# Altium schematic sheet Output Transceivers.SchDoc
size A2; SheetNumber: 6; SheetTotal: 8
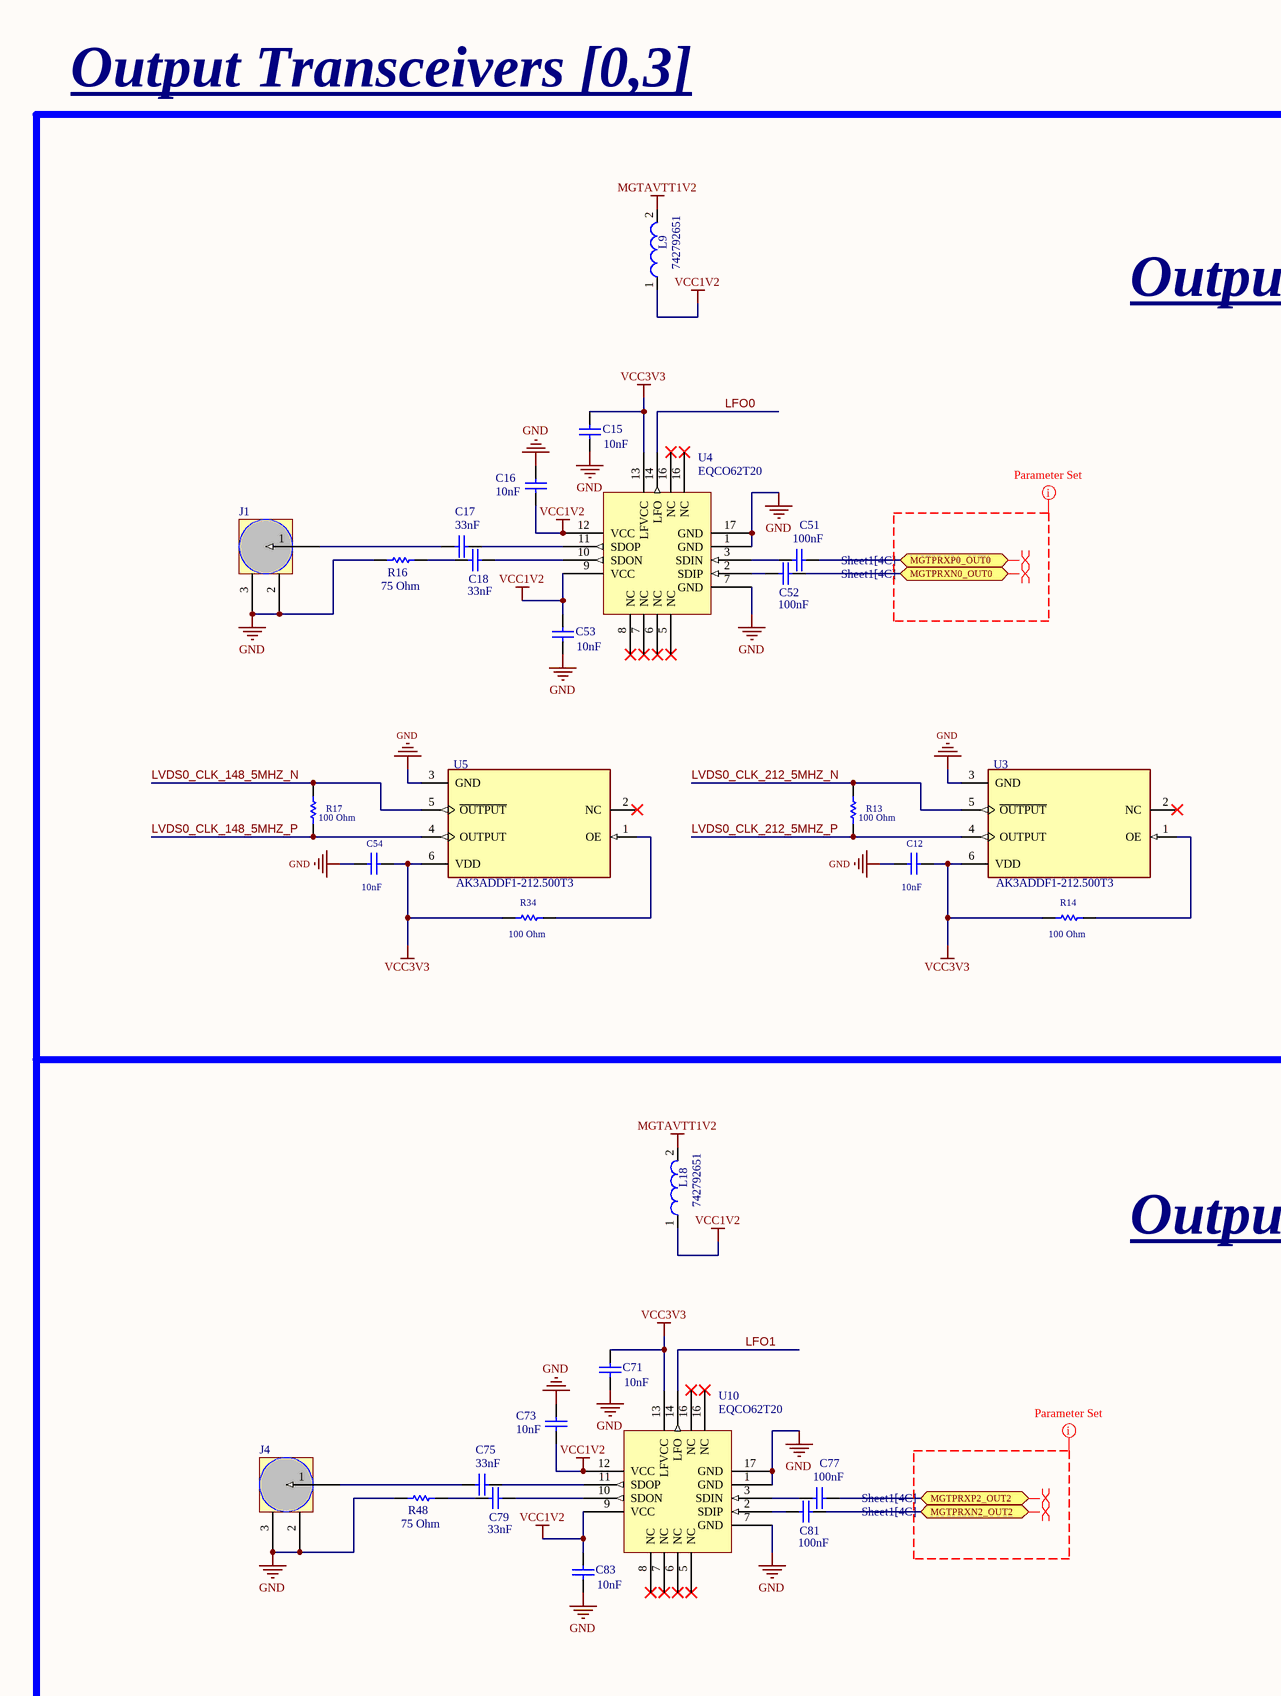
[diagram p0: Output Transceivers.SchDoc, left]
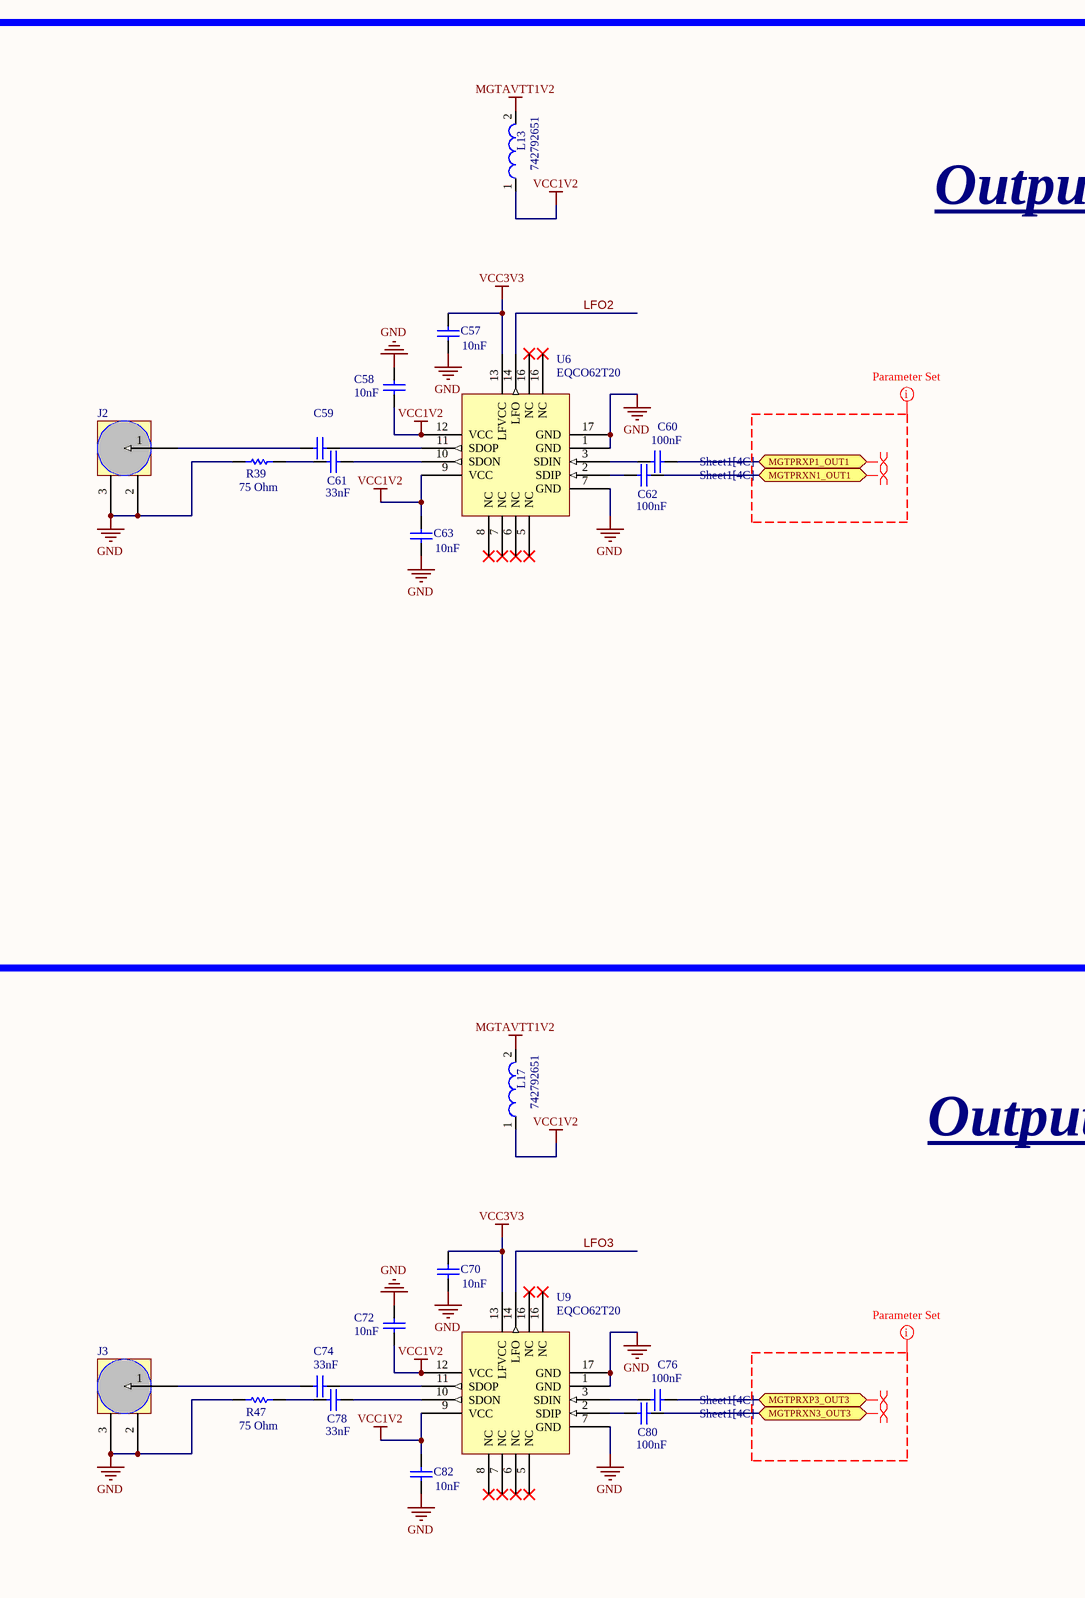
[diagram p1: Output Transceivers.SchDoc, right]

## Parts
C12  10nF  [0402]
C15  10nF  [0402]
C16  10nF  [0402]
C17  33nF  [0603]
C18  33nF  [0603]
C51  100nF  [0402]
C52  100nF  [0402]
C53  10nF  [0402]
C54  10nF  [0402]
C57  10nF  [0402]
C58  10nF  [0402]
C59  33nF  [0603]  (value not drawn)
C60  100nF  [0402]
C61  33nF  [0603]
C62  100nF  [0402]
C63  10nF  [0402]
C70  10nF  [0402]
C71  10nF  [0402]
C72  10nF  [0402]
C73  10nF  [0402]
C74  33nF  [0603]
C75  33nF  [0603]
C76  100nF  [0402]
C77  100nF  [0402]
C78  33nF  [0603]
C79  33nF  [0603]
C80  100nF  [0402]
C81  100nF  [0402]
C82  10nF  [0402]
C83  10nF  [0402]
J1  (no value)  [PCBComponent_1 - duplicate]
J2  (no value)  [PCBComponent_1 - duplicate]
J3  (no value)  [PCBComponent_1 - duplicate]
J4  (no value)  [PCBComponent_1 - duplicate]
L9  742792651  [SMD-0603]
L13  742792651  [SMD-0603]
L17  742792651  [SMD-0603]
L18  742792651  [SMD-0603]
R13  100 Ohm  [3-0603]
R14  100 Ohm  [3-0603]
R16  75 Ohm  [3-0603]
R17  100 Ohm  [3-0603]
R34  100 Ohm  [3-0603]
R39  75 Ohm  [3-0603]
R47  75 Ohm  [3-0603]
R48  75 Ohm  [3-0603]
U3  AK3ADDF1-212.500T3  [AX3DAF1-148.5000T]
U4  EQCO62T20  [PCBComponent_1_2]
U5  AK3ADDF1-212.500T3  [AX3DAF1-148.5000T]
U6  EQCO62T20  [PCBComponent_1_2]
U9  EQCO62T20  [PCBComponent_1_2]
U10  EQCO62T20  [PCBComponent_1_2]

## Ports
MGTPRXN0_OUT0 (bidir, see Sheet1[4C]), MGTPRXN1_OUT1 (bidir, see Sheet1[4C]), MGTPRXN2_OUT2 (bidir, see Sheet1[4C]), MGTPRXN3_OUT3 (bidir, see Sheet1[4C]), MGTPRXP0_OUT0 (bidir, see Sheet1[4C]), MGTPRXP1_OUT1 (bidir, see Sheet1[4C]), MGTPRXP2_OUT2 (bidir, see Sheet1[4C]), MGTPRXP3_OUT3 (bidir, see Sheet1[4C])

## Nets
GND: C12.1 C15.1 C16.2 C53.1 C54.1 C57.1 C58.2 C63.1 C70.1 C71.1 C72.2 C73.2 C82.1 C83.1 J1.2 J1.3 J2.2 J2.3 J3.2 J3.3 J4.2 J4.3 R16.1 R39.1 R47.1 R48.1 U3.3(GND) U4.1(GND) U4.7(GND) U4.17(GND) U5.3(GND) U6.1(GND) U6.7(GND) U6.17(GND) U9.1(GND) U9.7(GND) U9.17(GND) U10.1(GND) U10.7(GND) U10.17(GND)
MGTAVTT1V2: L9.2 L13.2 L17.2 L18.2
VCC1V2: C16.1 C53.2 C58.1 C63.2 C72.1 C73.1 C82.2 C83.2 L9.1 L13.1 L17.1 L18.1 U4.9(VCC) U4.12(VCC) U6.9(VCC) U6.12(VCC) U9.9(VCC) U9.12(VCC) U10.9(VCC) U10.12(VCC)
VCC3V3: C12.2 C15.2 C54.2 C57.2 C70.2 C71.2 R14.1 R34.1 U3.6(VDD) U4.13(LFVCC) U5.6(VDD) U6.13(LFVCC) U9.13(LFVCC) U10.13(LFVCC)
LFO0: U4.14(LFO)
LFO1: U10.14(LFO)
LFO2: U6.14(LFO)
LFO3: U9.14(LFO)
LVDS0_CLK_148_5MHZ_N: R17.2 U5.5(~{OUTPUT})
LVDS0_CLK_148_5MHZ_P: R17.1 U5.4(OUTPUT)
LVDS0_CLK_212_5MHZ_N: R13.2 U3.5(~{OUTPUT})
LVDS0_CLK_212_5MHZ_P: R13.1 U3.4(OUTPUT)
MGTPRXN0_OUT0: C52.2 ; port MGTPRXN0_OUT0
MGTPRXN1_OUT1: C62.2 ; port MGTPRXN1_OUT1
MGTPRXN2_OUT2: C81.2 ; port MGTPRXN2_OUT2
MGTPRXN3_OUT3: C80.2 ; port MGTPRXN3_OUT3
MGTPRXP0_OUT0: C51.2 ; port MGTPRXP0_OUT0
MGTPRXP1_OUT1: C60.2 ; port MGTPRXP1_OUT1
MGTPRXP2_OUT2: C77.2 ; port MGTPRXP2_OUT2
MGTPRXP3_OUT3: C76.2 ; port MGTPRXP3_OUT3
NetC17_1: C17.1 J1.1
NetC17_2: C17.2 U4.11(SDOP)
NetC18_1: C18.1 R16.2
NetC18_2: C18.2 U4.10(SDON)
NetC51_1: C51.1 U4.3(SDIN)
NetC52_1: C52.1 U4.2(SDIP)
NetC59_1: C59.1 J2.1
NetC59_2: C59.2 U6.11(SDOP)
NetC60_1: C60.1 U6.3(SDIN)
NetC61_1: C61.1 R39.2
NetC61_2: C61.2 U6.10(SDON)
NetC62_1: C62.1 U6.2(SDIP)
NetC74_1: C74.1 J3.1
NetC74_2: C74.2 U9.11(SDOP)
NetC75_1: C75.1 J4.1
NetC75_2: C75.2 U10.11(SDOP)
NetC76_1: C76.1 U9.3(SDIN)
NetC77_1: C77.1 U10.3(SDIN)
NetC78_1: C78.1 R47.2
NetC78_2: C78.2 U9.10(SDON)
NetC79_1: C79.1 R48.2
NetC79_2: C79.2 U10.10(SDON)
NetC80_1: C80.1 U9.2(SDIP)
NetC81_1: C81.1 U10.2(SDIP)
NetR14_2: R14.2 U3.1(OE)
NetR34_2: R34.2 U5.1(OE)

Not connected (* = marked no-connect by the designer): U3 2(NC)*; U4 5(NC)* 6(NC)* 8(NC)* 16(NC)*; U5 2(NC)*; U6 5(NC)* 6(NC)* 8(NC)* 16(NC)*; U9 5(NC)* 6(NC)* 8(NC)* 16(NC)*; U10 5(NC)* 6(NC)* 8(NC)* 16(NC)*

## Layout directives
differential pair: MGTPRXN0_OUT0, MGTPRXN1_OUT1, MGTPRXN2_OUT2, MGTPRXN3_OUT3, MGTPRXP0_OUT0, MGTPRXP1_OUT1, MGTPRXP2_OUT2, MGTPRXP3_OUT3

## Notes on the sheet
- Output Transceivers [0,3]
- Output 0
- Output 2
- Output 1
- Output 3

## Library data of the parts
C12 C15 C16 C53 C54 C57 C58 C63 C70-C73 C82 C83 = C0402: C0402C103K9RACTU 10nF 6.3V; Note: Footprint corresponds to dimensions for bulk cassette packaging. This case size has tightened tolerances.; Published: 17-Jul-2002; LatestRevisionDate: 19-Mar-2004; LatestRevisionNote: Silkscreen size reduced.; DatasheetDocument: Mar-2001; PackageDocument: Mar-2001; PackageReference: 0402; Publisher: Altium Limited; Code_JEITA: 0402; Code_IPC: 1005 [0402]; ComponentLink1Description: Manufacturer Link; ComponentLink1URL: http://www.kemet.com/; ComponentLink2Description: Datasheet; ComponentLink2URL: http://www.kemet.com/kemet/web/homepage/kechome.nsf/vapubfilesname/F3102TA.pdf/$file/F3102TA.pdf
C17 C18 C59 C61 C74 C75 C78 C79 = C0603: C0603C333K5RACTU 33nF 50V; Note: Footprint corresponds to dimensions for bulk cassette packaging. This case size has tightened tolerances.; Published: 17-Jul-2002; LatestRevisionDate: 19-Mar-2004; LatestRevisionNote: Silkscreen size reduced.; DatasheetDocument: Mar-2001; PackageDocument: Mar-2001; PackageReference: 0603; Publisher: Altium Limited; Code_JEITA: 0603; Code_IPC: 1608 [0603]; ComponentLink1Description: Manufacturer Link; ComponentLink1URL: http://www.kemet.com/; ComponentLink2Description: Datasheet; ComponentLink2URL: http://www.kemet.com/kemet/web/homepage/kechome.nsf/vapubfilesname/F3102TA.pdf/$file/F3102TA.pdf
  C17 C18 C61 C74 C75 C78 C79: Value: 33nF
C51 C52 C60 C62 C76 C77 C80 C81 = C0402: C0402C104K8RACTU 100nF 10V; Note: Footprint corresponds to dimensions for bulk cassette packaging. This case size has tightened tolerances.; Published: 17-Jul-2002; LatestRevisionDate: 19-Mar-2004; LatestRevisionNote: Silkscreen size reduced.; DatasheetDocument: Mar-2001; PackageDocument: Mar-2001; PackageReference: 0402; Publisher: Altium Limited; Code_JEITA: 0402; Code_IPC: 1005 [0402]; ComponentLink1Description: Manufacturer Link; ComponentLink1URL: http://www.kemet.com/; ComponentLink2Description: Datasheet; ComponentLink2URL: http://www.kemet.com/kemet/web/homepage/kechome.nsf/vapubfilesname/F3102TA.pdf/$file/F3102TA.pdf; Value: 100nF
J1-J4 = Component_1: Amphenol_BNC_HD_034_1018
L9 L13 L17 L18 = 742792651: SMD EMI Suppression Ferrite Bead WE-CBF, Z = 600 Ohm; Impedance: 600 Ohm; DatasheetVersion: Dec-2005; PackageVersion: 2009; PackageReference: SMD-0603; PackageDescription: Chip Inductor, 2-Leads, Body 1.6 x 0.8 mm; ComponentLink1Description: Manufacturer URL; ComponentLink1URL: http://www.we-online.com; ComponentLink2Description: Datasheet; ComponentLink2URL: http://www.we-online.de/katalog/media/pdf/742792651.pdf
R13 R14 R16 R17 R34 R39 R47 R48 = ERJ3EK: Precision Thick Film Chip Resistor, 10 Ohm to 1M Ohm Range, 1% and 0.5% Tolerance, 0603 Size, 0.063 W; Published: 17-Dec-2003; LatestRevisionDate: 19-Mar-2004; LatestRevisionNote: Silkscreen size reduced.; PackageDocument: Mar-2003; PackageReference: 3-0603; Publisher: Altium Limited; Code_IPC: 1608 [0603]; ComponentLink1Description: Manufacturer Link; ComponentLink1URL: http://www.panasonic.com/industrial/components/resistive_products.htm; ComponentLink2Description: Datasheet; ComponentLink2URL: http://www.panasonic.com/industrial/components/pdf/AOA0000CE2.pdf
U3 U5 = AX3DAF1-148.5000T: 148.5 MHz XO (Standard) LVDS Oscillator 3.3V Enable/Disable 6-SMD, No Lead; Part_Number: J00001; Part_Name: AX3DAF1-148.5000T3; ID: 110; Mounting_Type: SMT; ComponentLink1Description: Datasheet
U4 U6 U9 U10 = Component_1